# EAGLE design Adafruit NeoPixel Ring 24 B (EAGLE 9.5.2)
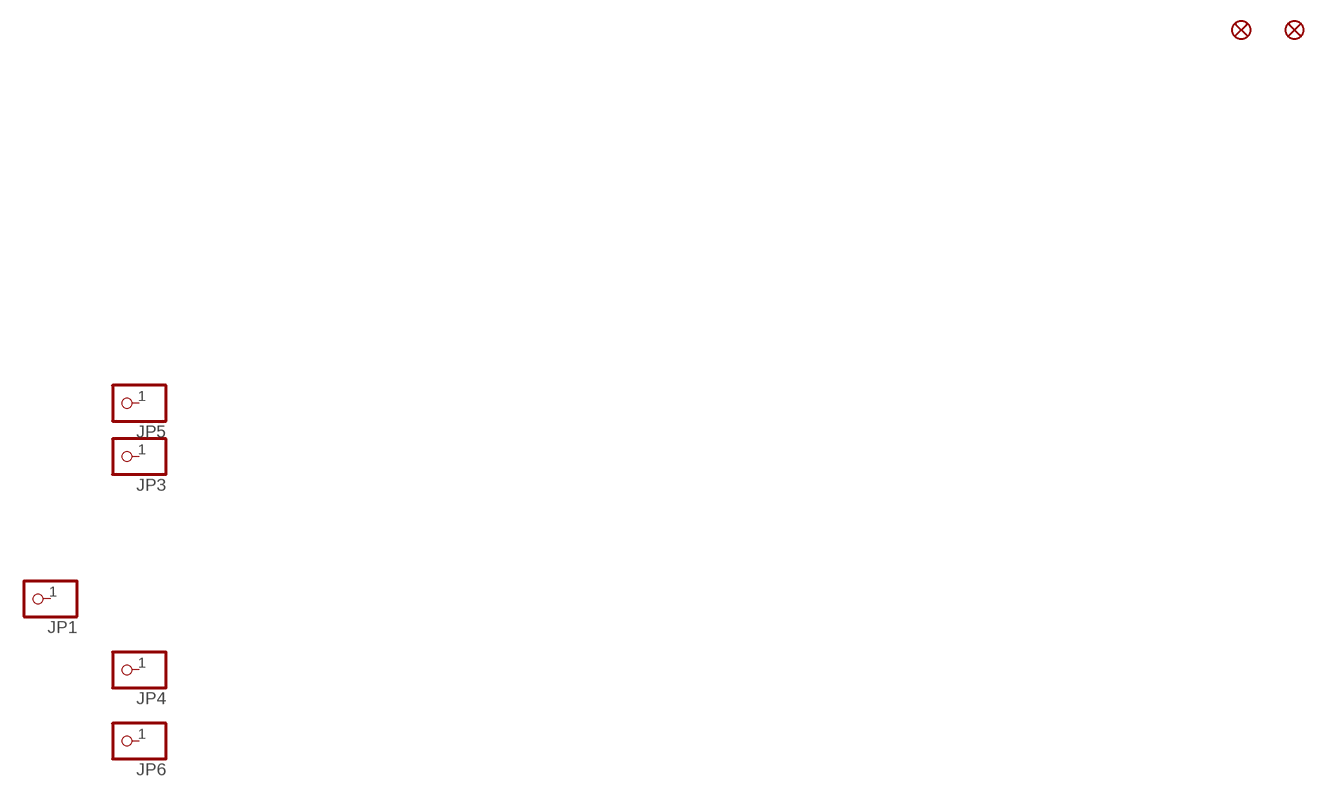
[diagram p0: schematic, sheet 1, part 1 of 2]
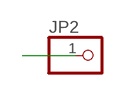
[diagram p1: schematic, sheet 1, part 2 of 2]

## Parts
FID1  FIDUCIAL""  [FIDUCIAL_1MM]
FID2  FIDUCIAL""  [FIDUCIAL_1MM]
JP1  PINHD-1X1CB  [1X01-CLEANBIG]
JP2  PINHD-1X1CB  [1X01-CLEANBIG]
JP3  PINHD-1X1CB  [1X01-CLEANBIG]
JP4  PINHD-1X1CB  [1X01-CLEANBIG]
JP5  PINHD-1X1CB  [1X01-CLEANBIG]
JP6  PINHD-1X1CB  [1X01-CLEANBIG]

## Nets
N$24: JP2.1
Unconnected: JP1.1 JP3.1 JP4.1 JP5.1 JP6.1

## Library data of the parts
FID1 FID2 = microbuilder:FIDUCIAL: Fiducial Alignment Points Various fiducial points for machine vision alignment.; BOM: EXCLUDE
JP1-JP6 = NeoPixelRing:PINHD-1X1: Pin header 1x1 for 0.1" spacing With round pins

## Board
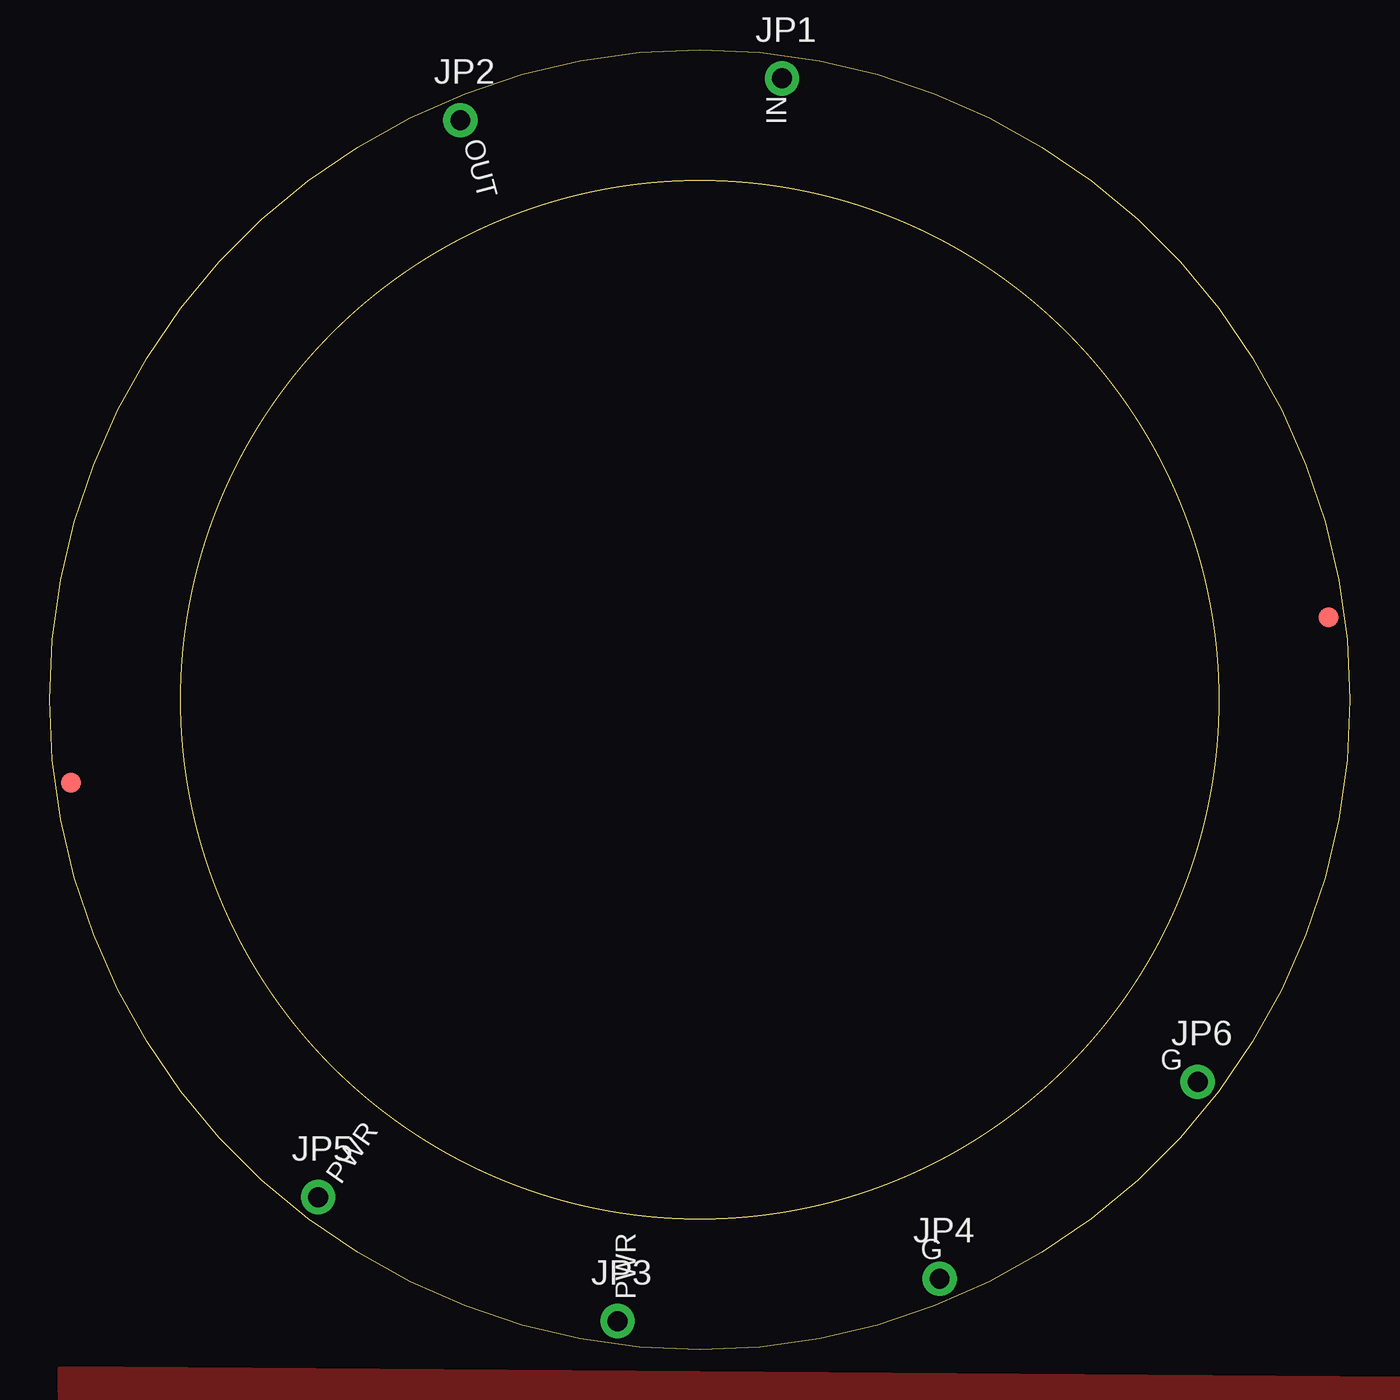
[diagram p2: board, top side]
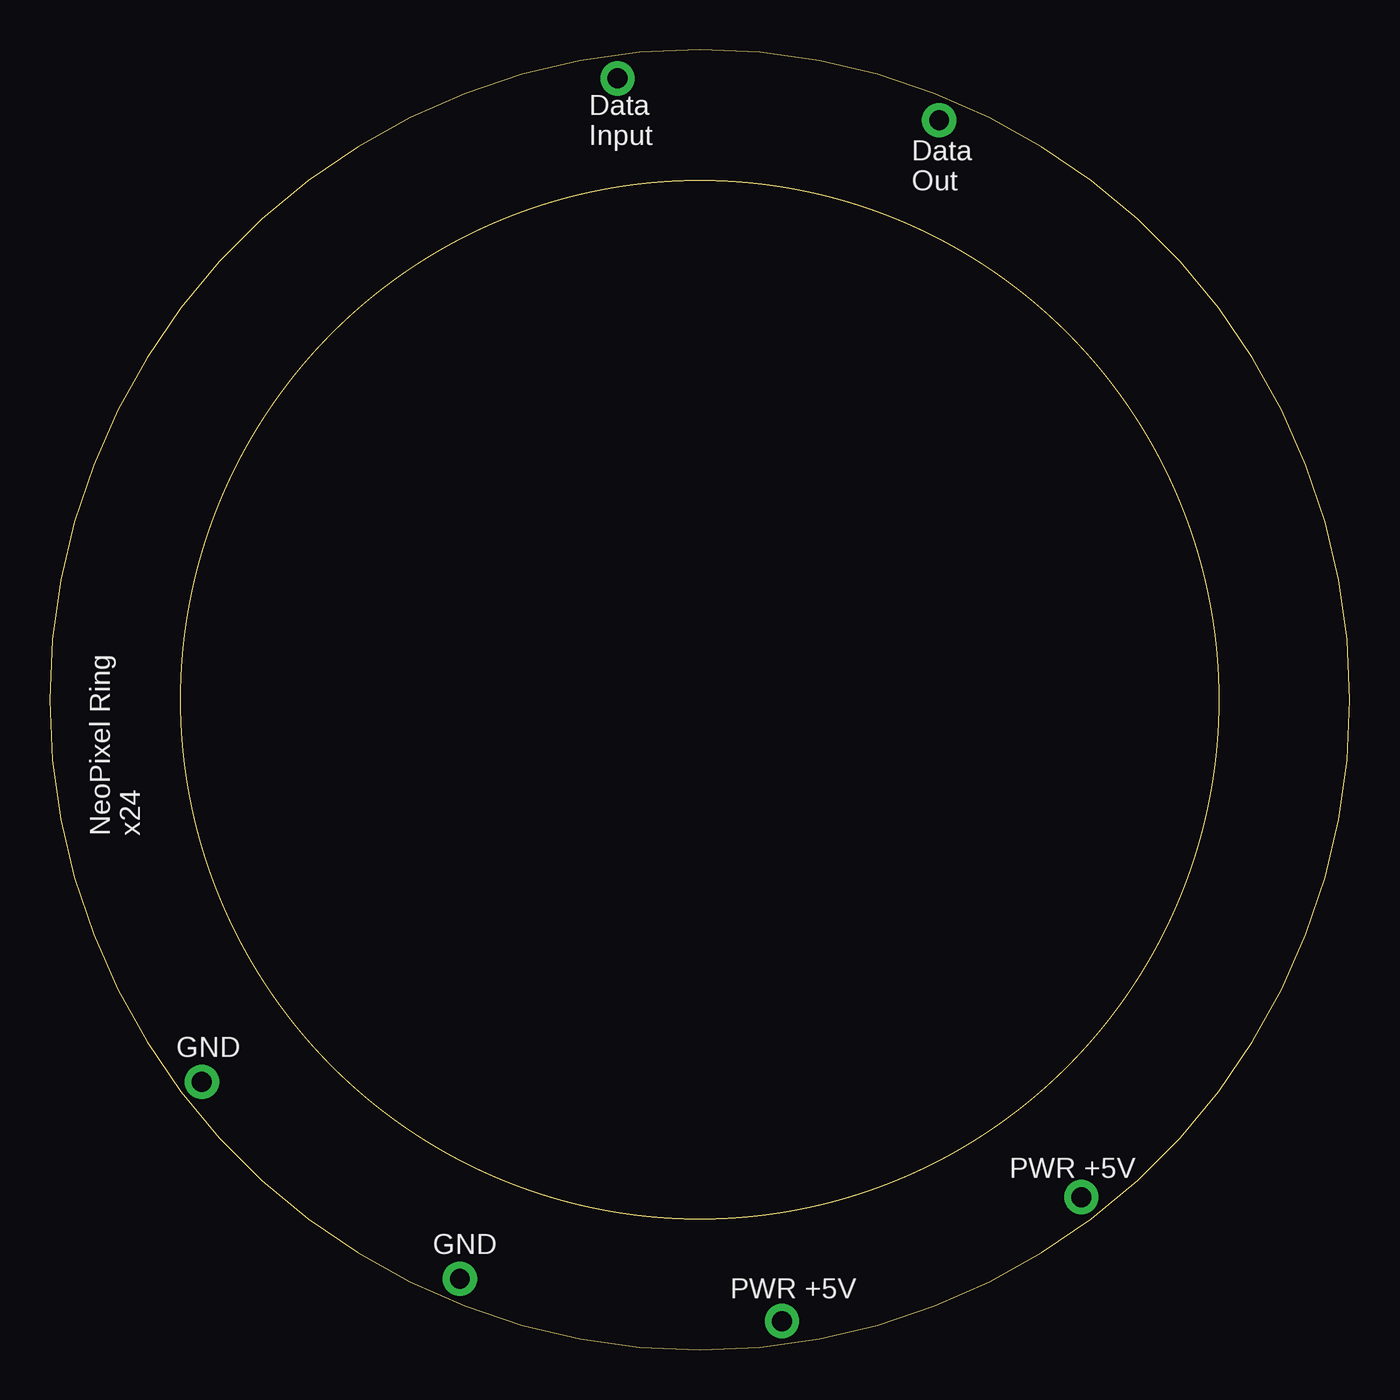
[diagram p3: board, bottom side, seen from below]

Size 65.53 x 65.53 mm. Coordinates in mm from the lower left corner, seen from the top.
Outline: 0,32.77 arc-90 32.77,65.53 arc-90 65.53,32.77 arc-90 32.77,0 arc-90 0,32.77
Outline: circle at 32.77,32.77 radius 26.16
Copper layers (1*16): Top 0.035mm / dielectric 1.5mm / Bottom 0.035mm
Design rules "adafruit": minimum track width 8mil, minimum drill 15.5mil, track to track 8mil, track to pad 8mil, pad to pad 8mil, via to via 8mil, smd to smd 8mil, copper to edge 10mil, drill to drill 8mil, minimum pad ring 10mil, minimum via ring 8mil, stop-mask expansion 4mil, vias tented up to drill 20mil, thermal gap 10mil

### Footprints (pad centres in the part's own frame; a part is rotated, then mirrored left to right if it is on the bottom)
FIDUCIAL_1MM = smd 1 x 1: 1 0,0
1X01-CLEANBIG = drill 1 pad 1.727: 1 0,0

### Placement (x,y rotation side)
FID1  1.07,28.57 0 top
FID2  64.47,36.93 0 top
JP1  36.91,64.08 0 top
JP2  20.7,61.98 0 top
JP3  28.63,1.45 0 top
JP4  44.86,3.58 0 top
JP5  13.54,7.7 0 top
JP6  57.86,13.51 0 top
U$1  [ADAFRUIT_5MM]  84.03,45.4 0 bottom  (outside the outline)

### Tracks (layer width: path | path; a pad name or v marks a point on that pad's centre or on a via)
GND
  pour Top (rank 2): 0.51,-0.96 0.62,-10.45 68.35,-10.97 68.24,-1.48
VDD
  pour Bottom: -16.31,10.23 -16.6,-15.13 -4.65,-15.09 -4.36,10.28

### Text on the board
tPlace: IN | OUT | G | PWR | G | PWR
bPlace: Data / Input | Data / Out | NeoPixel Ring / x24 | GND | PWR +5V | GND | PWR +5V